# Altium project RST32.PrjPcb
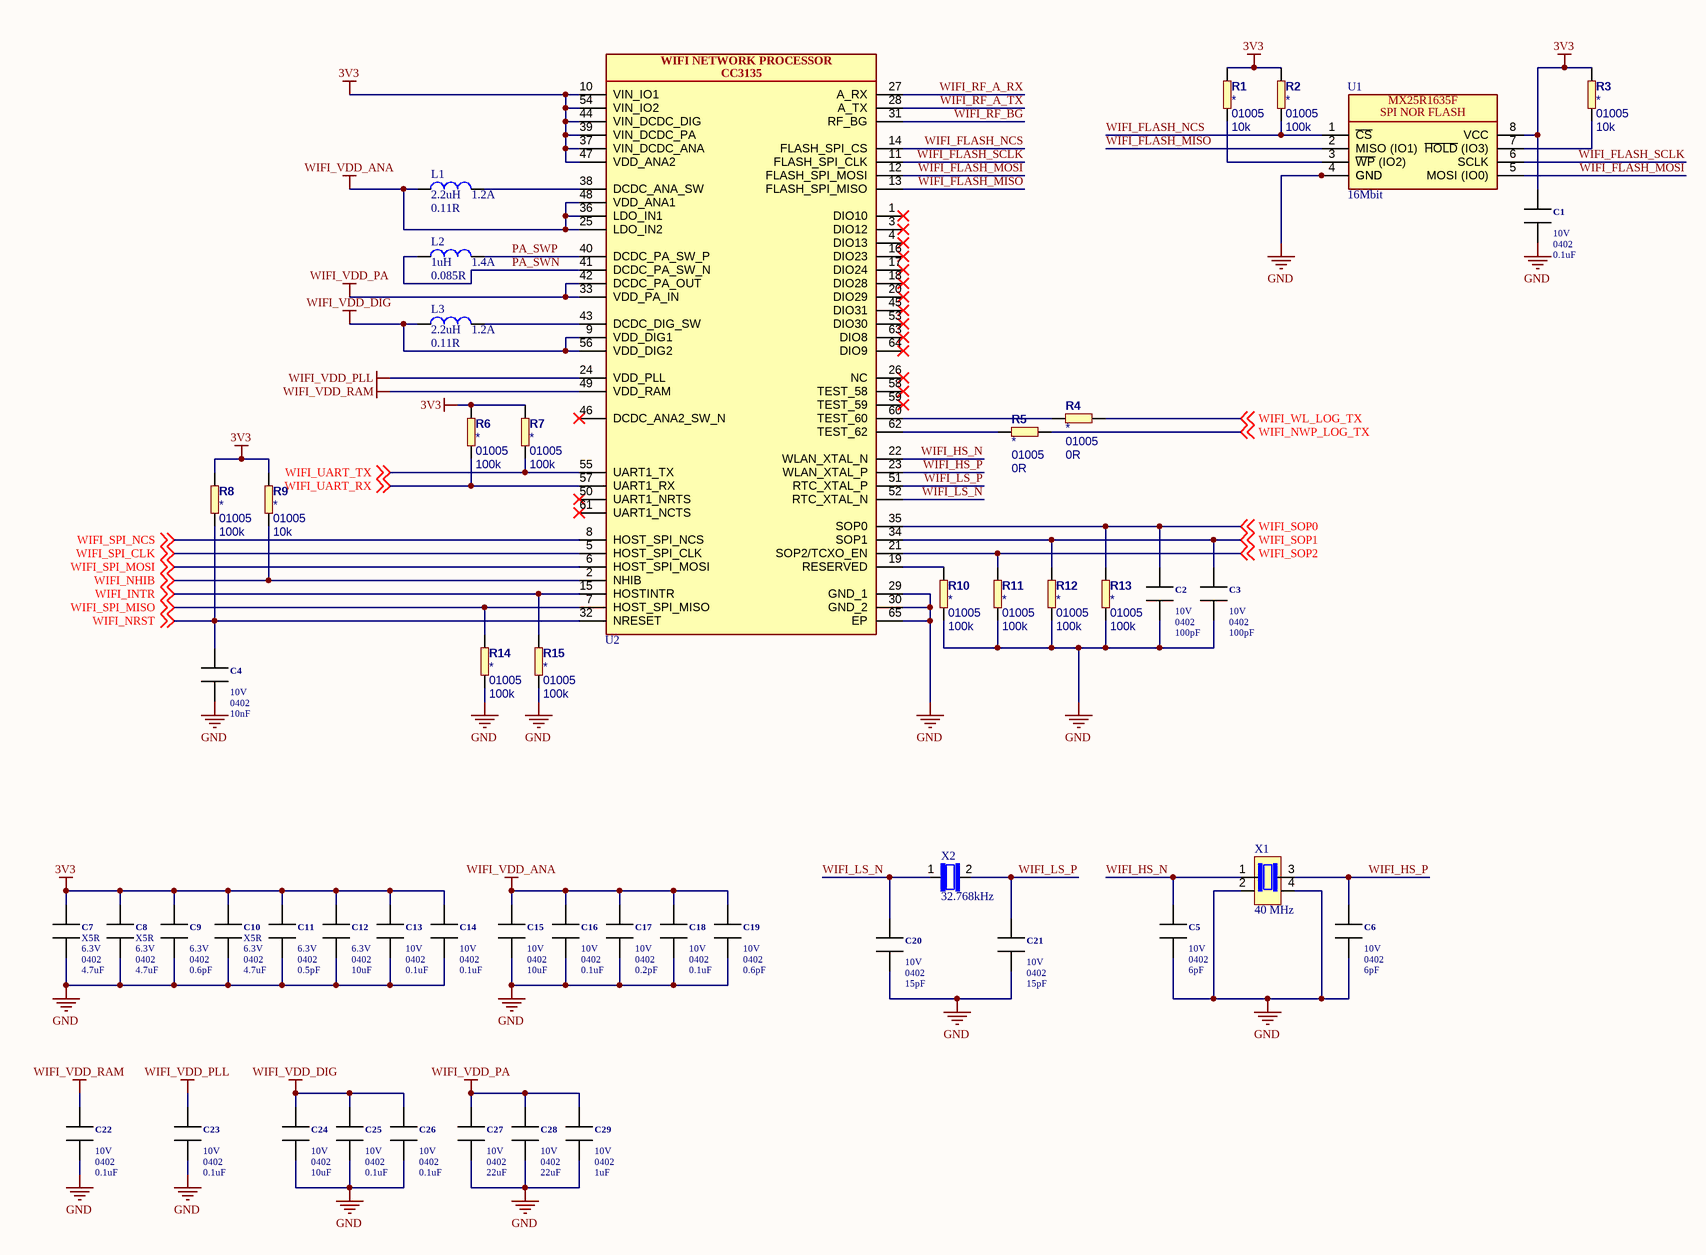
[diagram p0: CC3135_WIFI.SchDoc]
1 sheet, 51 parts. Net scope: global (net labels, ports and power ports of the same name join across sheets).
Board file: RST32.PcbDoc

## Sheet CC3135_WIFI.SchDoc: CC3135 WIFI BRIDGE
size 420 x 297 mm; SheetNumber: 1; SheetTotal: 1

### Parts
C1  Voltage: 10V  Package: 0402  Capacitance: 0.1uF  [MLCC_0402_(1005)]  (hidden comment: MLCC_0402_(1005))
C2  Voltage: 10V  Package: 0402  Capacitance: 100pF  [MLCC_0402_(1005)]  (hidden comment: MLCC_0402_(1005))
C3  Voltage: 10V  Package: 0402  Capacitance: 100pF  [MLCC_0402_(1005)]  (hidden comment: MLCC_0402_(1005))
C4  Voltage: 10V  Package: 0402  Capacitance: 10nF  [MLCC_0402_(1005)]  (hidden comment: MLCC_0402_(1005))
C5  Voltage: 10V  Package: 0402  Capacitance: 6pF  [MLCC_0402_(1005)]  (hidden comment: MLCC_0402_(1005))
C6  Voltage: 10V  Package: 0402  Capacitance: 6pF  [MLCC_0402_(1005)]  (hidden comment: MLCC_0402_(1005))
C7  Dielectric: X5R  Voltage: 6.3V  Package: 0402  Capacitance: 4.7uF  [MLCC_0402_(1005)]  (hidden comment: MLCC_0402_(1005))
C8  Dielectric: X5R  Voltage: 6.3V  Package: 0402  Capacitance: 4.7uF  [MLCC_0402_(1005)]  (hidden comment: MLCC_0402_(1005))
C9  Voltage: 6.3V  Package: 0402  Capacitance: 0.6pF  [MLCC_0402_(1005)]  (hidden comment: MLCC_0402_(1005))
C10  Dielectric: X5R  Voltage: 6.3V  Package: 0402  Capacitance: 4.7uF  [MLCC_0402_(1005)]  (hidden comment: MLCC_0402_(1005))
C11  Voltage: 6.3V  Package: 0402  Capacitance: 0.5pF  [MLCC_0402_(1005)]  (hidden comment: MLCC_0402_(1005))
C12  Voltage: 6.3V  Package: 0402  Capacitance: 10uF  [MLCC_0402_(1005)]  (hidden comment: MLCC_0402_(1005))
C13  Voltage: 10V  Package: 0402  Capacitance: 0.1uF  [MLCC_0402_(1005)]  (hidden comment: MLCC_0402_(1005))
C14  Voltage: 10V  Package: 0402  Capacitance: 0.1uF  [MLCC_0402_(1005)]  (hidden comment: MLCC_0402_(1005))
C15  Voltage: 10V  Package: 0402  Capacitance: 10uF  [MLCC_0402_(1005)]  (hidden comment: MLCC_0402_(1005))
C16  Voltage: 10V  Package: 0402  Capacitance: 0.1uF  [MLCC_0402_(1005)]  (hidden comment: MLCC_0402_(1005))
C17  Voltage: 10V  Package: 0402  Capacitance: 0.2pF  [MLCC_0402_(1005)]  (hidden comment: MLCC_0402_(1005))
C18  Voltage: 10V  Package: 0402  Capacitance: 0.1uF  [MLCC_0402_(1005)]  (hidden comment: MLCC_0402_(1005))
C19  Voltage: 10V  Package: 0402  Capacitance: 0.6pF  [MLCC_0402_(1005)]  (hidden comment: MLCC_0402_(1005))
C20  Voltage: 10V  Package: 0402  Capacitance: 15pF  [MLCC_0402_(1005)]  (hidden comment: MLCC_0402_(1005))
C21  Voltage: 10V  Package: 0402  Capacitance: 15pF  [MLCC_0402_(1005)]  (hidden comment: MLCC_0402_(1005))
C22  Voltage: 10V  Package: 0402  Capacitance: 0.1uF  [MLCC_0402_(1005)]  (hidden comment: MLCC_0402_(1005))
C23  Voltage: 10V  Package: 0402  Capacitance: 0.1uF  [MLCC_0402_(1005)]  (hidden comment: MLCC_0402_(1005))
C24  Voltage: 10V  Package: 0402  Capacitance: 10uF  [MLCC_0402_(1005)]  (hidden comment: MLCC_0402_(1005))
C25  Voltage: 10V  Package: 0402  Capacitance: 0.1uF  [MLCC_0402_(1005)]  (hidden comment: MLCC_0402_(1005))
C26  Voltage: 10V  Package: 0402  Capacitance: 0.1uF  [MLCC_0402_(1005)]  (hidden comment: MLCC_0402_(1005))
C27  Voltage: 10V  Package: 0402  Capacitance: 22uF  [MLCC_0402_(1005)]  (hidden comment: MLCC_0402_(1005))
C28  Voltage: 10V  Package: 0402  Capacitance: 22uF  [MLCC_0402_(1005)]  (hidden comment: MLCC_0402_(1005))
C29  Voltage: 10V  Package: 0402  Capacitance: 1uF  [MLCC_0402_(1005)]  (hidden comment: MLCC_0402_(1005))
L1  value 2.2uH  DCR: 0.11R  ISAT: 1.2A  [LQM2MPN]  (hidden comment: LQM2MPN)
L2  value 1uH  DCR: 0.085R  ISAT: 1.4A  [LQM2MPN]  (hidden comment: LQM2MPN)
L3  value 2.2uH  DCR: 0.11R  ISAT: 1.2A  [LQM2MPN]  (hidden comment: LQM2MPN)
R1  Package: 01005  Resistance: 10k  [RES_01005_(0402)]  (hidden comment: RES_01005_(0402))
R2  Package: 01005  Resistance: 100k  [RES_01005_(0402)]  (hidden comment: RES_01005_(0402))
R3  Package: 01005  Resistance: 10k  [RES_01005_(0402)]  (hidden comment: RES_01005_(0402))
R4  Package: 01005  Resistance: 0R  [RES_01005_(0402)]  (hidden comment: RES_01005_(0402))
R5  Package: 01005  Resistance: 0R  [RES_01005_(0402)]  (hidden comment: RES_01005_(0402))
R6  Package: 01005  Resistance: 100k  [RES_01005_(0402)]  (hidden comment: RES_01005_(0402))
R7  Package: 01005  Resistance: 100k  [RES_01005_(0402)]  (hidden comment: RES_01005_(0402))
R8  Package: 01005  Resistance: 100k  [RES_01005_(0402)]  (hidden comment: RES_01005_(0402))
R9  Package: 01005  Resistance: 10k  [RES_01005_(0402)]  (hidden comment: RES_01005_(0402))
R10  Package: 01005  Resistance: 100k  [RES_01005_(0402)]  (hidden comment: RES_01005_(0402))
R11  Package: 01005  Resistance: 100k  [RES_01005_(0402)]  (hidden comment: RES_01005_(0402))
R12  Package: 01005  Resistance: 100k  [RES_01005_(0402)]  (hidden comment: RES_01005_(0402))
R13  Package: 01005  Resistance: 100k  [RES_01005_(0402)]  (hidden comment: RES_01005_(0402))
R14  Package: 01005  Resistance: 100k  [RES_01005_(0402)]  (hidden comment: RES_01005_(0402))
R15  Package: 01005  Resistance: 100k  [RES_01005_(0402)]  (hidden comment: RES_01005_(0402))
U1  value 16Mbit  [MX25R1635FZU]  (hidden comment: MX25R1635F)
U2  CC3135RNMRGKR  [QFN50P900X900X100-65N-D]  (value not drawn)
X1  Frequency: 40 MHz  [ABM13W]  (hidden comment: ABM13W)
X2  Frequency: 32.768kHz  [ECX-1210]  (hidden comment: ECX-1210)

### Nets
3V3: C1.1 C7.1 C8.1 C9.1 C10.1 C11.1 C12.1 C13.1 C14.1 R1.2 R2.1 R3.2 R6.1 R7.1 R8.1 R9.1 U1.8(VCC) U2.10(VIN_IO1) U2.37(VIN_DCDC_ANA) U2.39(VIN_DCDC_PA) U2.44(VIN_DCDC_DIG) U2.47(VDD_ANA2) U2.54(VIN_IO2)
GND: C1.2 C2.2 C3.2 C4.2 C5.2 C6.2 C7.2 C8.2 C9.2 C10.2 C11.2 C12.2 C13.2 C14.2 C15.2 C16.2 C17.2 C18.2 C19.2 C20.2 C21.2 C22.2 C23.2 C24.2 C25.2 C26.2 C27.2 C28.2 C29.2 R10.2 R11.2 R12.2 R13.2 R14.2 R15.2 U1.4(GND) U1.9(GND) U2.29(GND_1) U2.30(GND_2) U2.65(EP) X1.2 X1.4
WIFI_VDD_ANA: C15.1 C16.1 C17.1 C18.1 C19.1 L1.1 U2.25(LDO_IN2) U2.36(LDO_IN1) U2.48(VDD_ANA1)
WIFI_VDD_DIG: C24.1 C25.1 C26.1 L3.1 U2.9(VDD_DIG1) U2.56(VDD_DIG2)
WIFI_VDD_PA: C27.1 C28.1 C29.1 U2.33(VDD_PA_IN) U2.42(DCDC_PA_OUT)
WIFI_VDD_PLL: C23.1 U2.24(VDD_PLL)
WIFI_VDD_RAM: C22.1 U2.49(VDD_RAM)
PA_SWN: L2.1 U2.41(DCDC_PA_SW_N)
PA_SWP: L2.2 U2.40(DCDC_PA_SW_P)
WIFI_FLASH_MISO: U1.2(MISO_(IO1)) U2.13(FLASH_SPI_MISO)
WIFI_FLASH_MOSI: U1.5(MOSI_(IO0)) U2.12(FLASH_SPI_MOSI)
WIFI_FLASH_NCS: R2.2 U1.1(~{CS}) U2.14(FLASH_SPI_CS)
WIFI_FLASH_SCLK: U1.6(SCLK) U2.11(FLASH_SPI_CLK)
WIFI_HS_N: C5.1 U2.22(WLAN_XTAL_N) X1.1
WIFI_HS_P: C6.1 U2.23(WLAN_XTAL_P) X1.3
WIFI_INTR: R15.1 U2.15(HOSTINTR) ; off-sheet WIFI_INTR
WIFI_LS_N: C20.1 U2.52(RTC_XTAL_N) X2.1
WIFI_LS_P: C21.1 U2.51(RTC_XTAL_P) X2.2
WIFI_NHIB: R9.2 U2.2(NHIB) ; off-sheet WIFI_NHIB
WIFI_NRST: C4.1 R8.2 U2.32(NRESET) ; off-sheet WIFI_NRST
WIFI_NWP_LOG_TX: R5.2 ; off-sheet WIFI_NWP_LOG_TX
WIFI_RF_A_RX: U2.27(A_RX)
WIFI_RF_A_TX: U2.28(A_TX)
WIFI_RF_BG: U2.31(RF_BG)
WIFI_SOP0: C2.1 R13.1 U2.35(SOP0) ; off-sheet WIFI_SOP0
WIFI_SOP1: C3.1 R12.1 U2.34(SOP1) ; off-sheet WIFI_SOP1
WIFI_SOP2: R11.1 U2.21(SOP2/TCXO_EN) ; off-sheet WIFI_SOP2
WIFI_SPI_CLK: U2.5(HOST_SPI_CLK) ; off-sheet WIFI_SPI_CLK
WIFI_SPI_MISO: R14.1 U2.7(HOST_SPI_MISO) ; off-sheet WIFI_SPI_MISO
WIFI_SPI_MOSI: U2.6(HOST_SPI_MOSI) ; off-sheet WIFI_SPI_MOSI
WIFI_SPI_NCS: U2.8(HOST_SPI_NCS) ; off-sheet WIFI_SPI_NCS
WIFI_UART_RX: R6.2 U2.57(UART1_RX) ; off-sheet WIFI_UART_RX
WIFI_UART_TX: R7.2 U2.55(UART1_TX) ; off-sheet WIFI_UART_TX
WIFI_WL_LOG_TX: R4.2 ; off-sheet WIFI_WL_LOG_TX
NetL1_2: L1.2 U2.38(DCDC_ANA_SW)
NetL3_2: L3.2 U2.43(DCDC_DIG_SW)
NetR1_1: R1.1 U1.3(~{WP}_(IO2))
NetR3_1: R3.1 U1.7(~{HOLD}_(IO3))
NetR4_1: R4.1 U2.60(TEST_60)
NetR5_1: R5.1 U2.62(TEST_62)
NetR10_1: R10.1 U2.19(RESERVED)

Not connected (* = marked no-connect by the designer): U2 1(DIO10)* 3(DIO12)* 4(DIO13)* 16(DIO23)* 17(DIO24)* 18(DIO28)* 20(DIO29)* 26(NC)* 45(DIO31)* 46(DCDC_ANA2_SW_N)* 50(UART1_NRTS)* 53(DIO30)* 58(TEST_58)* 59(TEST_59)* 61(UART1_NCTS)* 63(DIO8)* 64(DIO9)*

### Notes on the sheet
- Project:
- Size:
- Drawn By:
- File Name:
- A3
- Title:
- Sheet:
- Date:
- Rev:
- of
- (in symbol CC3135RNMRGKR) WIFI NETWORK PROCESSOR; CC3135
- (in symbol MX25R1635F) SPI NOR FLASH

### Library data of the parts
C7 C8 C10 = MLCC_0402_(1005): Manufacturer 1: Samsung Electro-Mechanics; Manufacturer Part Number 1: CL05A475MQ5NRNC; Supplier 1: JLCPCB; Supplier Part Number 1: C307423
L1-L3 = LQM2MPN: 1.2A 138mΩ 2.2uH 40MHz ±20% 0806 Inductors (SMD) ROHS; Manufacturer Part Number 1: LQM2MPN2R2MG0L; Manufacturer 1: Murata Electronics; Supplier 1: JLCPCB; Supplier Part Number 1: C86093
U1 = MX25R1635F: 1.65V~3.6V 100,000 Cycles 16Mbit 20 Years 3.2ms 80MHz SPI NOR FLASH ROHS; Manufacturer 1: MXIC(Macronix); Manufacturer Part Number 1: MX25R1635FZUIL0; Package: USON-8-EP(2x3); Supplier 1: JLCPCB; Supplier Part Number 1: C152595
U2 = CC3135RNMRGKR: -40℃~+85℃ -96dBm 18dBm 2.1V~3.6V 223mA 53mA 72Mbps SPI WiFi VQFN-64-EP(9x9) RF Transceiver ICs ROHS; Manufacturer 1: Texas Instruments; Manufacturer Part Number 1: CC3135RNMRGKR; Package: VQFN-64-EP(9x9); Supplier 1: *; Supplier Part Number 1: *
X1 = ABM13W: ABM13W Package; Package: SMD1210-2P; Supplier 1: *; Manufacturer Part Number 1: *; Manufacturer 1: *; Supplier Part Number 1: *
X2 = ECX-1210: ECX 1210 Package; Manufacturer Part Number 1: ECS-.327-12.5-1210-TR; Manufacturer 1: ECS; Package: SMD1210-2P; Supplier 1: JLCPCB; Supplier Part Number 1: C435179
C1-C6 C9 C11-C29 = MLCC_0402_(1005): Supplier 1: JLCPCB
R1-R15 = RES_01005_(0402): Manufacturer 1: *; Manufacturer Part Number 1: *; Supplier 1: *; Supplier Part Number 1: *; Power: *; Tolerance: *